# Altium schematic sheet Acceleration_module.SchDoc: Gyorsulásérzékelő modul
size A4; Author: Debreczeni László; Organization: BME-AUT; DocumentNumber: 4; Revision: A27; SheetNumber: 4; SheetTotal: 5
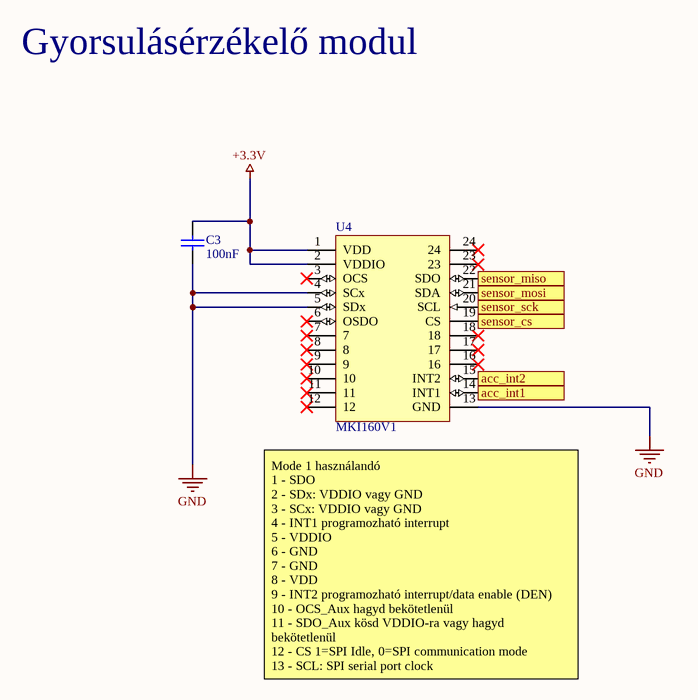
[diagram p0: Acceleration_module.SchDoc]

## Parts
C3  100nF  [FP_1206_CAP_125]
U4  MKI160V1  [FP_DIL24]

## Ports
acc_int1 (out), acc_int2 (out), sensor_cs (in), sensor_miso (out), sensor_mosi (in), sensor_sck (in)

## Nets
+3.3V: C3.2 U4.1(VDD) U4.2(VDDIO)
GND: C3.1 U4.4(SCx) U4.5(SDx) U4.13(GND)
acc_int1: U4.14(INT1) ; port acc_int1
acc_int2: U4.15(INT2) ; port acc_int2
sensor_cs: U4.19(CS) ; port sensor_cs
sensor_miso: U4.22(SDO) ; port sensor_miso
sensor_mosi: U4.21(SDA) ; port sensor_mosi
sensor_sck: U4.20(SCL) ; port sensor_sck

Not connected (* = marked no-connect by the designer): U4 3(OCS)* 6(OSDO)* 7* 8* 9* 10* 11* 12* 16* 17* 18* 23* 24*

## Notes on the sheet
- Gyorsulásérzékelő modul
- (near U4) Mode 1 használandó
  1 - SDO
  2 - SDx: VDDIO vagy GND
  3 - SCx: VDDIO vagy GND
  4 - INT1 programozható interrupt
  5 - VDDIO
  6 - GND
  7 - GND
  8 - VDD
  9 - INT2 programozható interrupt/data enable (DEN)
  10 - OCS_Aux hagyd bekötetlenül
  11 - SDO_Aux kösd VDDIO-ra vagy hagyd bekötetlenül
  12 - CS 1=SPI Idle, 0=SPI communication mode
  13 - SCL: SPI serial port clock
  14 - SDA: SDI/3-wire interface SDO
- Title
- Size:
- Date:
- A4
- Number:
- Time:
- Revision:
- Sheet
- of
- File:

## Library data of the parts
C3 = CAP: Capacitor; Tolerance: 10%; Voltage: 50V; Name: 100nF 1206 Capacitor; Supplier: Lomex; Reference: 82-14-64; Value: 100nF
U4 = MKI160V1: LSM6DS3 inertial module adapter; Name: MKI160V1 LSM6DS3 inertial module adapter; Reference: 511-STEVAL-MKI160V1; Supplier: Mouser